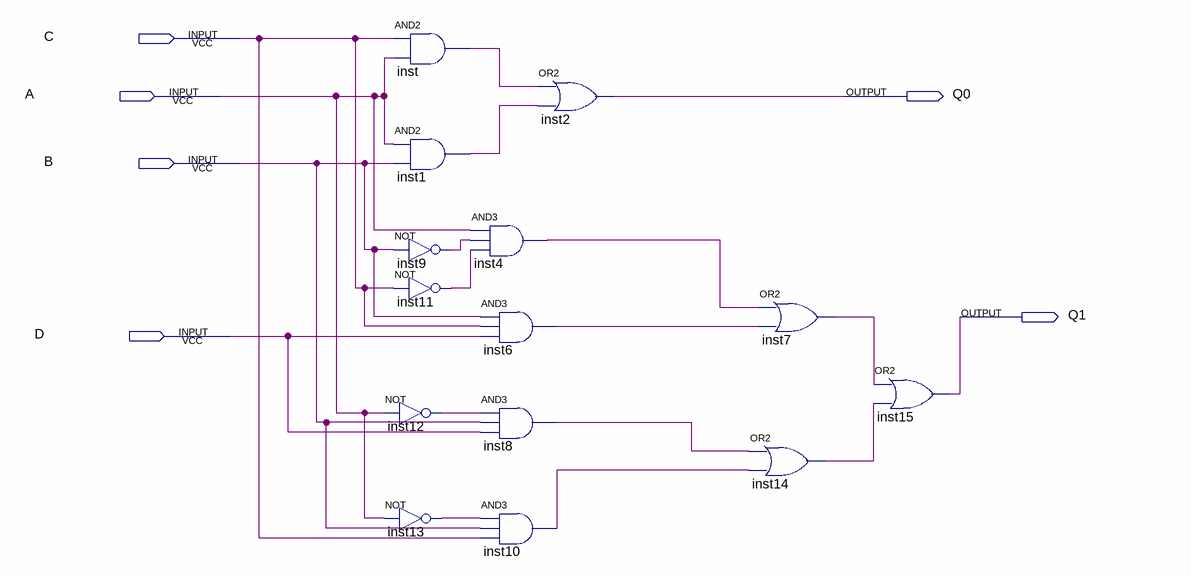
[diagram p0: schematic sheet]
// Quartus schematic DIVFIVEnew.bdf as structural Verilog: 14 symbols, 6 pins
module DIVFIVEnew (
  input  C,
  input  A,
  input  B,
  input  D,
  output Q0,
  output Q1
);

  wire inst1_out, inst4_out, inst6_out, inst7_out, inst8_out, inst9_out, inst10_out, inst11_out, inst12_out,
       inst13_out, inst14_out, inst_out;

  and inst (inst_out, C, A);
  and inst1 (inst1_out, A, B);
  not inst9 (inst9_out, B);
  not inst11 (inst11_out, C);
  not inst12 (inst12_out, A);
  not inst13 (inst13_out, A);
  and inst4 (inst4_out, A, inst9_out, inst11_out);
  or inst2 (Q0, inst_out, inst1_out);
  and inst6 (inst6_out, B, C, D);
  and inst8 (inst8_out, inst12_out, B, D);
  and inst10 (inst10_out, inst13_out, B, C);
  or inst7 (inst7_out, inst4_out, inst6_out);
  or inst14 (inst14_out, inst8_out, inst10_out);
  or inst15 (Q1, inst7_out, inst14_out);
endmodule
